# EAGLE schematic Works_008 (EAGLE 8.2.1)
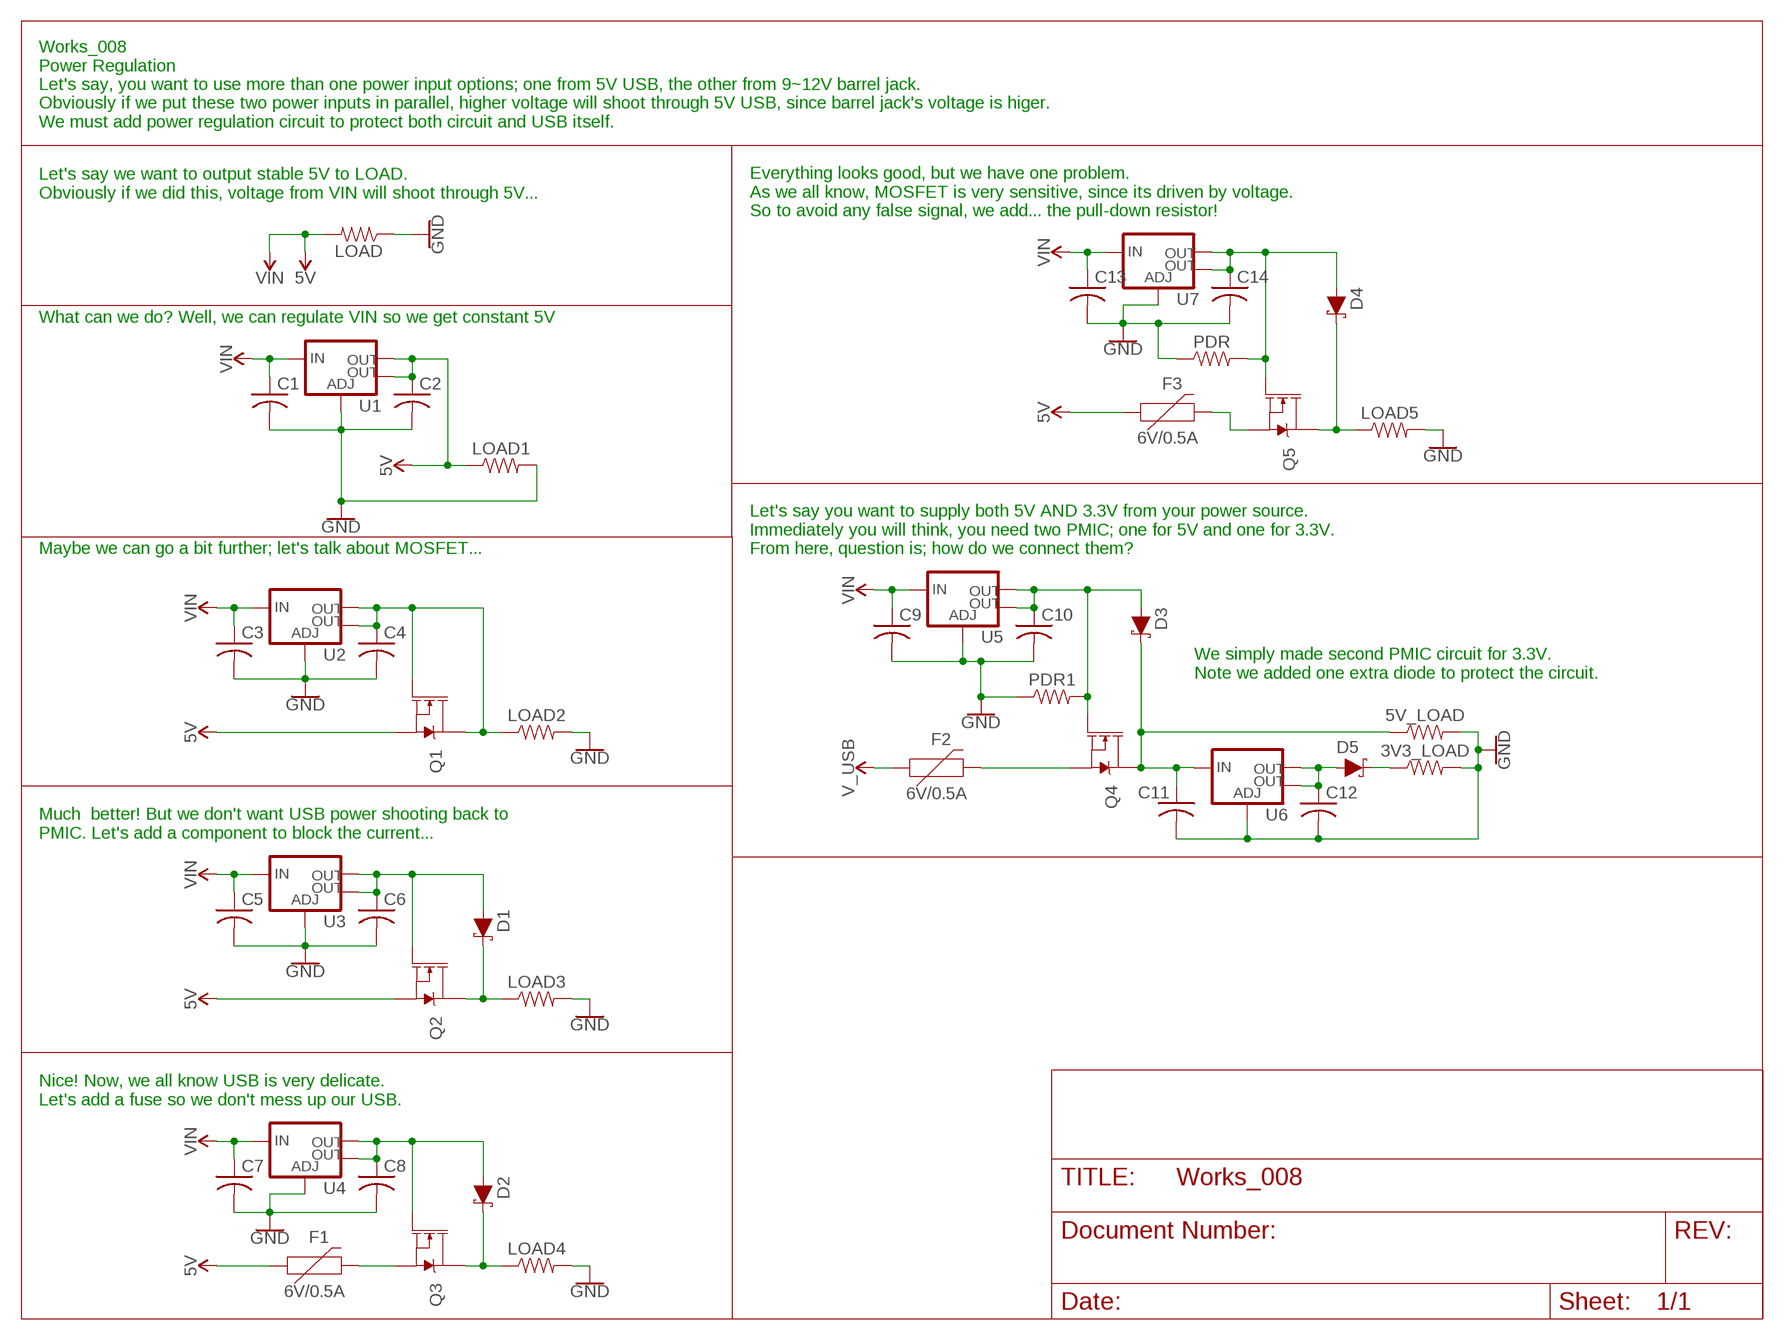
[diagram p0: schematic, sheet 1]

## Parts
3V3_LOAD  RESISTOR0805  [0805]
5V_LOAD  RESISTOR0805  [0805]
C1  C-USC0805  [C0805]
C2  C-USC0805  [C0805]
C3  C-USC0805  [C0805]
C4  C-USC0805  [C0805]
C5  C-USC0805  [C0805]
C6  C-USC0805  [C0805]
C7  C-USC0805  [C0805]
C8  C-USC0805  [C0805]
C9  C-USC0805  [C0805]
C10  C-USC0805  [C0805]
C11  C-USC0805  [C0805]
C12  C-USC0805  [C0805]
C13  C-USC0805  [C0805]
C14  C-USC0805  [C0805]
D1  DIODE-SCHOTTKY-B340A  [SMA-DIODE]
D2  DIODE-SCHOTTKY-B340A  [SMA-DIODE]
D3  DIODE-SCHOTTKY-B340A  [SMA-DIODE]
D4  DIODE-SCHOTTKY-B340A  [SMA-DIODE]
D5  DIODE-SCHOTTKY-B340A  [SMA-DIODE]
F1  6V/0.5A  PPTC_HALF-AMP  [1206]
F2  6V/0.5A  PPTC_HALF-AMP  [1206]
F3  6V/0.5A  PPTC_HALF-AMP  [1206]
LOAD  RESISTOR0805  [0805]
LOAD1  RESISTOR0805  [0805]
LOAD2  RESISTOR0805  [0805]
LOAD3  RESISTOR0805  [0805]
LOAD4  RESISTOR0805  [0805]
LOAD5  RESISTOR0805  [0805]
PDR  RESISTOR0805  [0805]
PDR1  RESISTOR0805  [0805]
Q1  MOSFET-NCH-FQP30N06L  [TO220V]
Q2  MOSFET-NCH-FQP30N06L  [TO220V]
Q3  MOSFET-NCH-FQP30N06L  [TO220V]
Q4  MOSFET-NCH-FQP30N06L  [TO220V]
Q5  MOSFET-NCH-FQP30N06L  [TO220V]
U1  V_REG_LM1117SOT223  [SOT223]
U2  V_REG_LM1117SOT223  [SOT223]
U3  V_REG_LM1117SOT223  [SOT223]
U4  V_REG_LM1117SOT223  [SOT223]
U5  V_REG_LM1117SOT223  [SOT223]
U6  V_REG_LM1117SOT223  [SOT223]
U7  V_REG_LM1117SOT223  [SOT223]

## Nets
5V: C2.1 F1.1 F3.1 LOAD1.1 LOAD.2 Q1.3(S) Q2.3(S) U1.2(OUT) U1.4(OUT) ; supply symbol labelled VIN
GND: 3V3_LOAD.2 5V_LOAD.2 C1.2 C2.2 C3.2 C4.2 C5.2 C6.2 C7.2 C8.2 C9.2 C10.2 C11.2 C12.2 C13.2 C14.2 LOAD1.2 LOAD2.2 LOAD3.2 LOAD4.2 LOAD5.2 LOAD.1 PDR1.1 PDR.1 U1.1(ADJ) U2.1(ADJ) U3.1(ADJ) U4.1(ADJ) U5.1(ADJ) U6.1(ADJ) U7.1(ADJ)
N$1: C4.1 LOAD2.1 Q1.1(G) Q1.2(D) U2.2(OUT) U2.4(OUT)
N$2: C8.1 D2.A Q3.1(G) U4.2(OUT) U4.4(OUT)
N$3: C6.1 D1.A Q2.1(G) U3.2(OUT) U3.4(OUT)
N$4: D1.C LOAD3.1 Q2.2(D)
N$5: D2.C LOAD4.1 Q3.2(D)
N$6: F1.2 Q3.3(S)
N$7: F3.2 Q5.3(S)
N$8: C10.1 D3.A PDR1.2 Q4.1(G) U5.2(OUT) U5.4(OUT)
N$9: C14.1 D4.A PDR.2 Q5.1(G) U7.2(OUT) U7.4(OUT)
N$10: 5V_LOAD.1 C11.1 D3.C Q4.2(D) U6.3(IN)
N$11: F2.2 Q4.3(S)
N$12: C12.1 D5.A U6.2(OUT) U6.4(OUT)
N$13: D4.C LOAD5.1 Q5.2(D)
N$14: 3V3_LOAD.1 D5.C
V_USB: F2.1
VIN: C1.1 C3.1 C5.1 C7.1 C9.1 C13.1 U1.3(IN) U2.3(IN) U3.3(IN) U4.3(IN) U5.3(IN) U7.3(IN)

## Notes on the sheet
- Works_008
  Power Regulation
  Let's say, you want to use more than one power input options; one from 5V USB, the other from 9~12V barrel jack.
  Obviously if we put these two power inputs in parallel, higher voltage will shoot through 5V USB, since barrel jack's voltage is higer.
  We must add power regulation circuit to protect both circuit and USB itself.
- Let's say we want to output stable 5V to LOAD.
  Obviously if we did this, voltage from VIN will shoot through 5V...
- Everything looks good, but we have one problem.
  As we all know, MOSFET is very sensitive, since its driven by voltage.
  So to avoid any false signal, we add... the pull-down resistor!
- What can we do? Well, we can regulate VIN so we get constant 5V
- Maybe we can go a bit further; let's talk about MOSFET...
- Let's say you want to supply both 5V AND 3.3V from your power source.
  Immediately you will think, you need two PMIC; one for 5V and one for 3.3V.
  From here, question is; how do we connect them?
- We simply made second PMIC circuit for 3.3V.
  Note we added one extra diode to protect the circuit.
- Much  better! But we don't want USB power shooting back to
  PMIC. Let's add a component to block the current...
- Nice! Now, we all know USB is very delicate.
  Let's add a fuse so we don't mess up our USB.

## Library data of the parts
3V3_LOAD 5V_LOAD LOAD LOAD1-LOAD5 PDR PDR1 = SparkFun-Resistors:RESISTOR: Generic Resistor Package
C1-C14 = adafruit:C-US: CAPACITOR, American symbol
D1-D5 = SparkFun-DiscreteSemi:DIODE-SCHOTTKY: Schottky diode A Schottky diode is a semiconductor diode which has a low forward voltage drop and a very fast switching action.; PROD_ID: DIO-09886; VALUE: 3A/40V/500mV
F1-F3 = SparkFun-Fuses:PPTC: Resettable Fuse PPTC Resettable Fuse. Really a sort of resistor with a polymeric positive temperature coefficient whose resistance increases dramatically with an increase in temperature. When heated by the power passing through the resistance rises causing the current to be limited, protecting the circuit. This is achieved by the transition of the polymer from a crystalline to an amorphous state where the conductive carbon separates breaking the conductive pathways found in the cool crystalline structure. When a PPTC cools back down it resumes conducting letting the circuit turn back on. SparkFun Products: SparkFun RedBoard - Programmed with Arduino <https://www.sparkfun.com/products/12757> Pro Micro - 5V/16MHz <https://www.sparkfun.com/products/12640> Arduino Pro 328 - 5V/16MHz <https://www.sparkfun.com/products/10915> MP3 Trigger <https://www.sparkfun.com/products/13720>; PROD_ID: RES-08585
Q1-Q5 = SparkFun-DiscreteSemi:MOSFET-NCH: N-channel MOSFETs Voltage controlled devices that allow control of high current outputs. SparkFun Products: SparkFun OpenScale <https://www.sparkfun.com/products/13261> SparkFun Digital Sandbox <https://www.sparkfun.com/products/12651> SparkFun Monster Moto Shield <https://www.sparkfun.com/products/10182> SparkFun MOSFET Power Controller <https://www.sparkfun.com/products/11214>; PROD_ID: TRANS-10060; VALUE: 60V/32A/35mΩ
U1-U7 = SparkFun-IC-Power:V_REG_LM1117: Voltage Regulator LM1117 Standard adjustable voltage regulator but in SMD form. Spark Fun Electronics SKU : COM-00595; PROD_ID: VREG-08170